# EAGLE design Motor Controller (EAGLE 8.6.0)
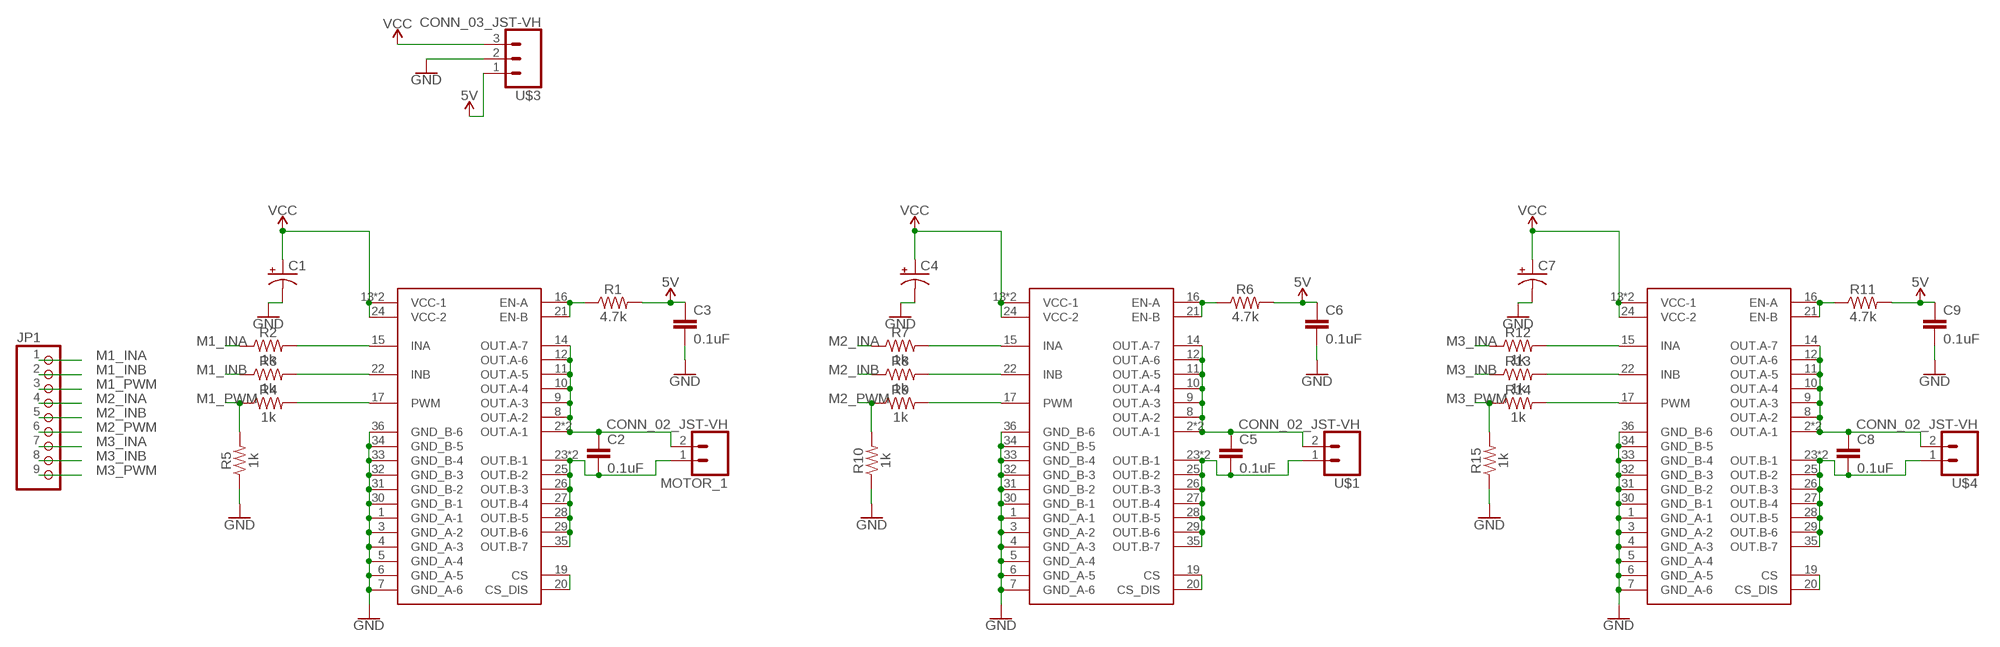
[diagram p0: schematic, sheet 1]

## Parts
C1  CPOL-USE3.5-8  [E3,5-8]
C2  0.1uF  0.1UF-0603-25V-(+80/-20%)  [0603]
C3  0.1uF  0.1UF-0603-25V-(+80/-20%)  [0603]
C4  CPOL-USE3.5-8  [E3,5-8]
C5  0.1uF  0.1UF-0603-25V-(+80/-20%)  [0603]
C6  0.1uF  0.1UF-0603-25V-(+80/-20%)  [0603]
C7  CPOL-USE3.5-8  [E3,5-8]
C8  0.1uF  0.1UF-0603-25V-(+80/-20%)  [0603]
C9  0.1uF  0.1UF-0603-25V-(+80/-20%)  [0603]
JP1  PINHD-1X9  [1X09]
M1  M1  SOP50P1030X247-36N  [SOP50P1030X247-36N]
M2  M2  SOP50P1030X247-36N  [SOP50P1030X247-36N]
M3  M3  SOP50P1030X247-36N  [SOP50P1030X247-36N]
MOTOR_1  CONN_02_JST-VH  [B2P-VH]
R1  4.7k  4.7KOHM-0603-1/10W-1%  [0603]
R2  1k  1KOHM-0603-1/10W-1%  [0603]
R3  1k  1KOHM-0603-1/10W-1%  [0603]
R4  1k  1KOHM-0603-1/10W-1%  [0603]
R5  1k  1KOHM-0603-1/10W-1%  [0603]
R6  4.7k  4.7KOHM-0603-1/10W-1%  [0603]
R7  1k  1KOHM-0603-1/10W-1%  [0603]
R8  1k  1KOHM-0603-1/10W-1%  [0603]
R9  1k  1KOHM-0603-1/10W-1%  [0603]
R10  1k  1KOHM-0603-1/10W-1%  [0603]
R11  4.7k  4.7KOHM-0603-1/10W-1%  [0603]
R12  1k  1KOHM-0603-1/10W-1%  [0603]
R13  1k  1KOHM-0603-1/10W-1%  [0603]
R14  1k  1KOHM-0603-1/10W-1%  [0603]
R15  1k  1KOHM-0603-1/10W-1%  [0603]
U$1  CONN_02_JST-VH  [B2P-VH]
U$3  CONN_03_JST-VH  [B3P-VH]
U$4  CONN_02_JST-VH  [B2P-VH]

## Nets
5V: C3.1 C6.1 C9.1 R1.2 R6.2 R11.2 U$3.1
GND: C1.- C3.2 C4.- C6.2 C7.- C9.2 M1.1(GND_A-1) M1.3(GND_A-2) M1.4(GND_A-3) M1.5(GND_A-4) M1.6(GND_A-5) M1.7(GND_A-6) M1.30(GND_B-1) M1.31(GND_B-2) M1.32(GND_B-3) M1.33(GND_B-4) M1.34(GND_B-5) M1.36(GND_B-6) M2.1(GND_A-1) M2.3(GND_A-2) M2.4(GND_A-3) M2.5(GND_A-4) M2.6(GND_A-5) M2.7(GND_A-6) M2.30(GND_B-1) M2.31(GND_B-2) M2.32(GND_B-3) M2.33(GND_B-4) M2.34(GND_B-5) M2.36(GND_B-6) M3.1(GND_A-1) M3.3(GND_A-2) M3.4(GND_A-3) M3.5(GND_A-4) M3.6(GND_A-5) M3.7(GND_A-6) M3.30(GND_B-1) M3.31(GND_B-2) M3.32(GND_B-3) M3.33(GND_B-4) M3.34(GND_B-5) M3.36(GND_B-6) R5.1 R10.1 R15.1 U$3.2
M1_INA: JP1.1 R2.1
M1_INB: JP1.2 R3.1
M1_PWM: JP1.3 R4.1 R5.2
M2_INA: JP1.4 R7.1
M2_INB: JP1.5 R8.1
M2_PWM: JP1.6 R9.1 R10.2
M3_INA: JP1.7 R12.1
M3_INB: JP1.8 R13.1
M3_PWM: JP1.9 R14.1 R15.2
N$1: C5.1 M2.2(OUT.A-1) M2.8(OUT.A-2) M2.9(OUT.A-3) M2.10(OUT.A-4) M2.11(OUT.A-5) M2.12(OUT.A-6) M2.14(OUT.A-7) M2.SLUG2(OUT.A-1) U$1.2
N$2: C2.1 M1.2(OUT.A-1) M1.8(OUT.A-2) M1.9(OUT.A-3) M1.10(OUT.A-4) M1.11(OUT.A-5) M1.12(OUT.A-6) M1.14(OUT.A-7) M1.SLUG2(OUT.A-1) MOTOR_1.2
N$3: C2.2 M1.23(OUT.B-1) M1.25(OUT.B-2) M1.26(OUT.B-3) M1.27(OUT.B-4) M1.28(OUT.B-5) M1.29(OUT.B-6) M1.35(OUT.B-7) M1.SLUG3(OUT.B-1) MOTOR_1.1
N$4: M1.19(CS) M1.20(CS_DIS)
N$5: M1.16(EN-A) M1.21(EN-B) R1.1
N$6: C5.2 M2.23(OUT.B-1) M2.25(OUT.B-2) M2.26(OUT.B-3) M2.27(OUT.B-4) M2.28(OUT.B-5) M2.29(OUT.B-6) M2.35(OUT.B-7) M2.SLUG3(OUT.B-1) U$1.1
N$7: M2.19(CS) M2.20(CS_DIS)
N$8: M1.15(INA) R2.2
N$9: M1.22(INB) R3.2
N$10: M1.17(PWM) R4.2
N$11: M2.16(EN-A) M2.21(EN-B) R6.1
N$12: M2.15(INA) R7.2
N$13: M2.22(INB) R8.2
N$14: M2.17(PWM) R9.2
N$15: C8.1 M3.2(OUT.A-1) M3.8(OUT.A-2) M3.9(OUT.A-3) M3.10(OUT.A-4) M3.11(OUT.A-5) M3.12(OUT.A-6) M3.14(OUT.A-7) M3.SLUG2(OUT.A-1) U$4.2
N$16: C8.2 M3.23(OUT.B-1) M3.25(OUT.B-2) M3.26(OUT.B-3) M3.27(OUT.B-4) M3.28(OUT.B-5) M3.29(OUT.B-6) M3.35(OUT.B-7) M3.SLUG3(OUT.B-1) U$4.1
N$17: M3.19(CS) M3.20(CS_DIS)
N$18: M3.16(EN-A) M3.21(EN-B) R11.1
N$19: M3.15(INA) R12.2
N$20: M3.22(INB) R13.2
N$21: M3.17(PWM) R14.2
VCC: C1.+ C4.+ C7.+ M1.13(VCC-1) M1.24(VCC-2) M1.SLUG1(VCC-1) M2.13(VCC-1) M2.24(VCC-2) M2.SLUG1(VCC-1) M3.13(VCC-1) M3.24(VCC-2) M3.SLUG1(VCC-1) U$3.3

## Library data of the parts
C1 C4 C7 = adafruit:CPOL-US: POLARIZED CAPACITOR, American symbol
C2 C3 C5 C6 C8 C9 = SparkFun-Capacitors:0.1UF: 0.1µF ceramic capacitors A capacitor is a passive two-terminal electrical component used to store electrical energy temporarily in an electric field.; PROD_ID: CAP-00810
JP1 = pinhead:PINHD-1X9: PIN HEADER
M1-M3 = VNH5050ATR-E:SOP50P1030X247-36N; A1_MAX: 0.32; A1_MIN: 0.23; A1_NOM: 0.275; A_MAX: 2.47; A_MIN: 2.15; A_NOM: 2.31; B_MAX: 0.36; B_MIN: 0.18; B_NOM: 0.27; D2_MAX: 0.0; D2_MIN: None; D2_NOM: None; D_MAX: 10.5; D_MIN: 10.1; D_NOM: 10.3; E1_MAX: 7.6; E1_MIN: 7.4; E1_NOM: 7.5; E2_MAX: 0.0; E2_MIN: None; E2_NOM: None; ENOM: 0.5; E_MAX: 10.5; E_MIN: 10.1; E_NOM: 10.3; L_MAX: 1.0; L_MIN: 0.6; L_NOM: 0.8; MANUFACTURER: STMicroelectronics; PIN_COUNT: 36.0; SNAPEDA_PACKAGE_ID: 23434
MOTOR_1 U$1 U$4 = JST-VH:CONN_02_JST-VH: B2P-VH(LF)(SN) Digikey <https://www.digikey.com.au/product-detail/en/jst-sales-america-inc/B2P-VH-LF-SN/455-1639-ND/926547>
R1 R6 R11 = SparkFun-Resistors:4.7KOHM: 4.7kΩ resistor A resistor is a passive two-terminal electrical component that implements electrical resistance as a circuit element. Resistors act to reduce current flow, and, at the same time, act to lower voltage levels within circuits. - Wikipedia; PROD_ID: RES-07857
R2-R5 R7-R10 R12-R15 = SparkFun-Resistors:1KOHM: 1kΩ resistor A resistor is a passive two-terminal electrical component that implements electrical resistance as a circuit element. Resistors act to reduce current flow, and, at the same time, act to lower voltage levels within circuits. - Wikipedia; PROD_ID: RES-07856
U$3 = JST-VH:CONN_03_JST-VH: B3P-VH(LF)(SN) Digikey <https://www.digikey.com.au/products/en?keywords=455-1640-ND>

## Board
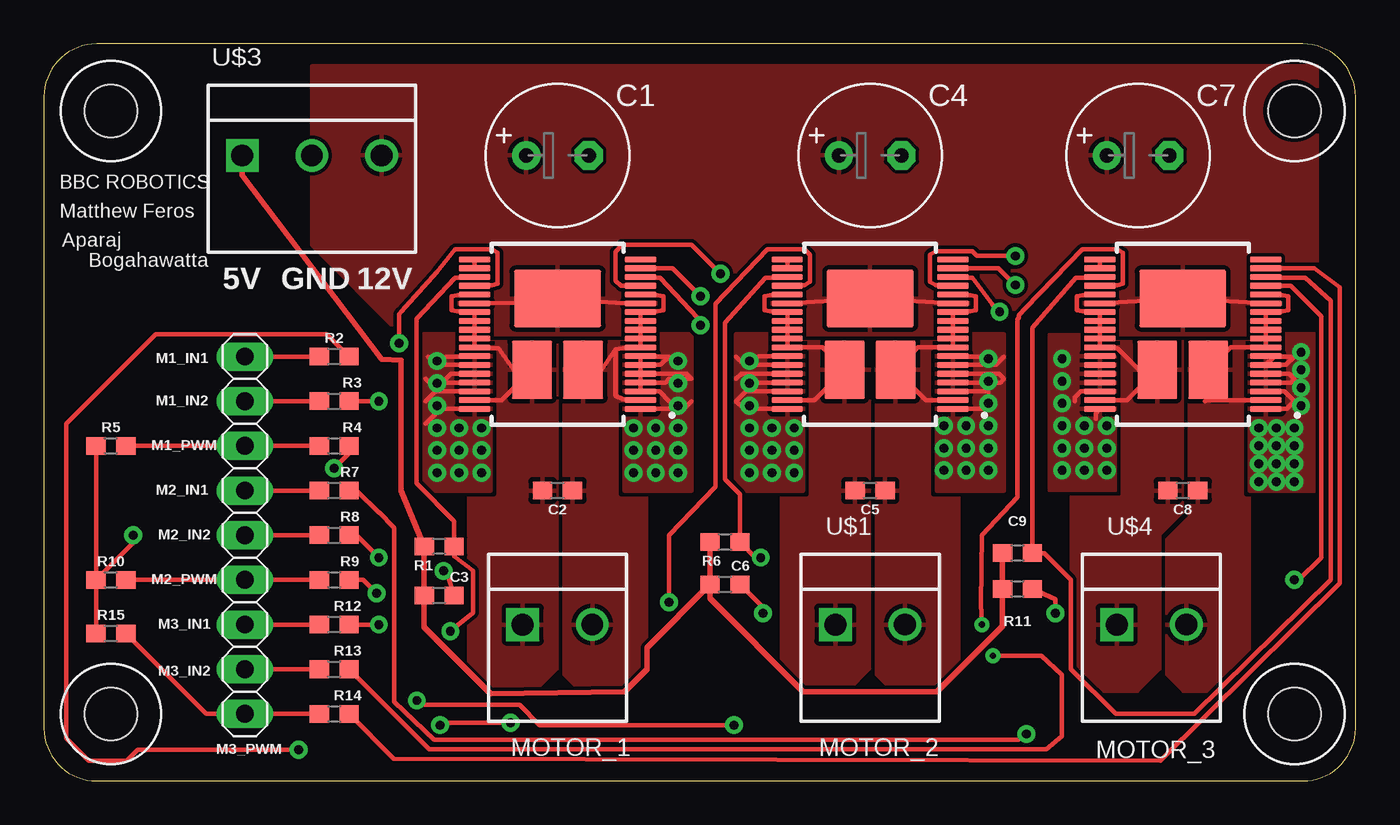
[diagram p1: board, top side]
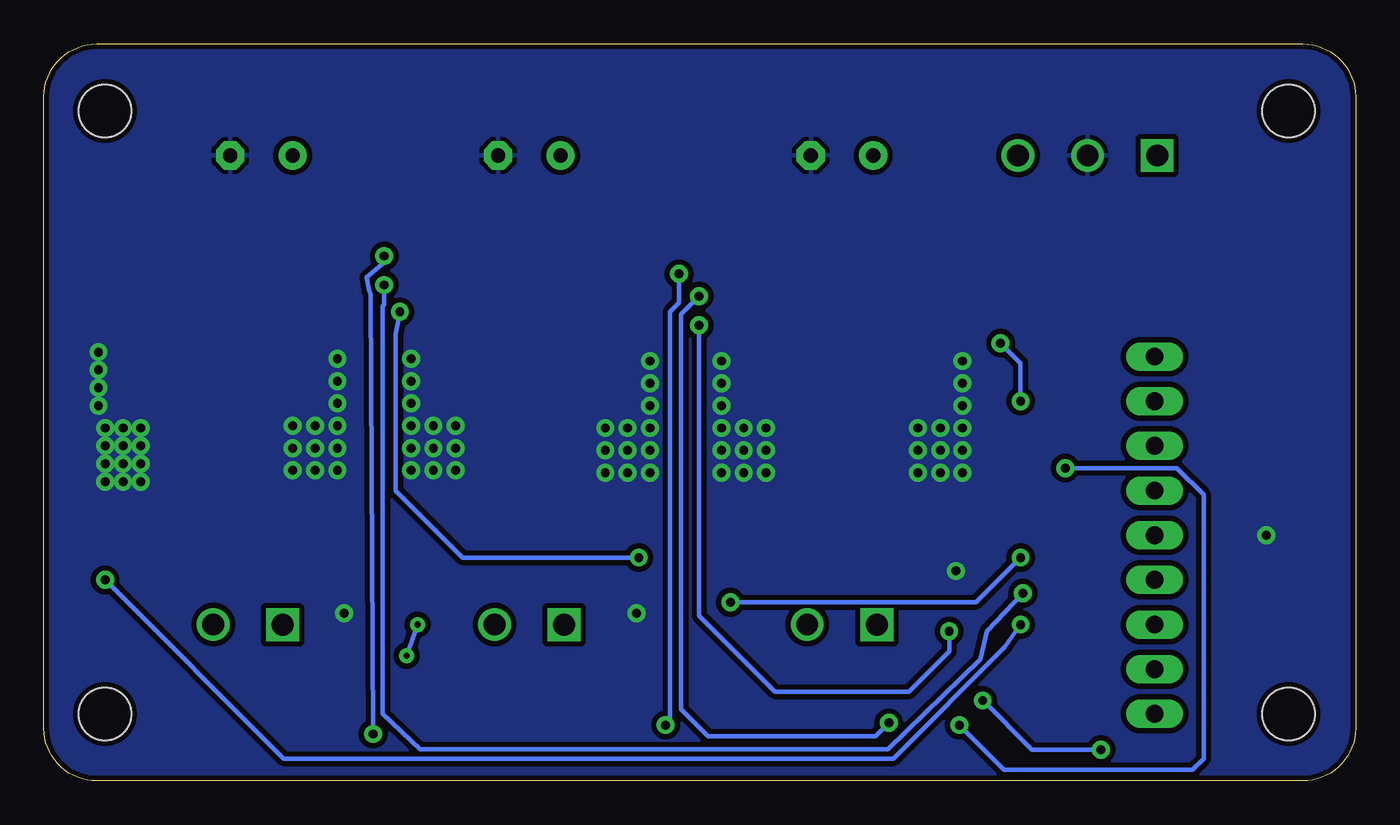
[diagram p2: board, bottom side, seen from below]

Size 74.6 x 41.9 mm. Coordinates in mm from the lower left corner, seen from the top.
Outline: 0,38.9 0,3 arc90 3,0 71.6,0 arc90 74.6,3 74.6,38.9 arc90 71.6,41.9 3,41.9 arc90 0,38.9
Copper layers (1*16): Top 0.035mm / dielectric 1.5mm / Bottom 0.035mm
Design rules "SparkFun": minimum track width 8mil, minimum drill 20mil, track to track 8mil, track to pad 8mil, pad to pad 8mil, via to via 8mil, smd to smd 8mil, copper to edge 10mil, drill to drill 8mil, minimum pad ring 12mil, minimum via ring 10mil, stop-mask expansion 4mil, vias tented up to drill 25mil, thermal gap 10mil
Holes 3 mm at 3.81,38.1 71.12,38.1 71.12,3.81 3.81,3.81

### Footprints (pad centres in the part's own frame; a part is rotated, then mirrored left to right if it is on the bottom)
E3,5-8 = drill 0.813 pad 1.6: + -1.778,0 | drill 0.813 pad 1.6 octagon: - 1.778,0
0603 = smd 1.1 x 1: 1 -0.85,0; 2 0.85,0
1X09 = drill 1.016 long: 1 -10.16,0; 2 -7.62,0; 3 -5.08,0; 4 -2.54,0; 5 0,0; 6 2.54,0; 7 5.08,0; 8 7.62,0; 9 10.16,0
SOP50P1030X247-36N = smd 1.79 x 0.35: 1 -4.715,4.25; 2 -4.715,3.75; 3 -4.715,3.25; 4 -4.715,2.75; 5 -4.715,2.25; 6 -4.715,1.75; 7 -4.715,1.25; 8 -4.715,0.75; 9 -4.715,0.25; 10 -4.715,-0.25; 11 -4.715,-0.75; 12 -4.715,-1.25; 13 -4.715,-1.75; 14 -4.715,-2.25; 15 -4.715,-2.75; 16 -4.715,-3.25; 17 -4.715,-3.75; 18 -4.715,-4.25; 19 4.715,-4.25; 20 4.715,-3.75; 21 4.715,-3.25; 22 4.715,-2.75; 23 4.715,-2.25; 24 4.715,-1.75; 25 4.715,-1.25; 26 4.715,-0.75; 27 4.715,-0.25; 28 4.715,0.25; 29 4.715,0.75; 30 4.715,1.25; 31 4.715,1.75; 32 4.715,2.25; 33 4.715,2.75; 34 4.715,3.25; 35 4.715,3.75; 36 4.715,4.25 | smd 4.95 x 3.25: SLUG1 0,-2.025 | smd 2.286 x 3.302: SLUG2 -1.45,2.025; SLUG3 1.45,2.025
B2P-VH = drill 1.25 square: 1 -1.98,0 | drill 1.24: 2 1.98,0
B3P-VH = drill 1.24 square: 1 -3.96,0 | drill 1.24: 2 0,0; 3 3.96,0

### Placement (x,y rotation side)
C1  29.21,35.56 0 top
C2  29.21,16.51 180 top
C3  22.48,10.54 0 top
C4  46.99,35.56 0 top
C5  46.99,16.51 180 top
C6  38.73,11.18 0 top
C7  62.23,35.56 0 top
C8  64.77,16.51 180 top
C9  55.37,10.92 0 top
JP1  11.43,13.97 270 top
M1  29.21,25.4 180 top
M2  46.99,25.4 180 top
M3  64.77,25.4 180 top
MOTOR_1  29.21,8.89 0 top
R1  22.48,13.34 180 top
R2  16.51,24.13 0 top
R3  16.51,21.59 0 top
R4  16.51,19.05 0 top
R5  3.81,19.05 0 top
R6  38.73,13.59 180 top
R7  16.51,16.51 0 top
R8  16.51,13.97 0 top
R9  16.51,11.43 0 top
R10  3.81,11.43 0 top
R11  55.37,12.95 180 top
R12  16.51,8.89 0 top
R13  16.51,6.35 0 top
R14  16.51,3.81 0 top
R15  3.81,8.38 0 top
U$1  46.99,8.89 0 top
U$3  15.24,35.56 0 top
U$4  62.99,8.89 0 top

### Tracks (layer width: path | path; a pad name or v marks a point on that pad's centre or on a via)
5V
  Top 0.305: R11.2 C9.1 54.52,8.8 50.8,5.08 43.18,5.08 37.88,10.38 C6.1 | C6.1 R6.2 | C6.1 34.29,7.58 34.29,6.35 33.02,5.08 25.4,4.95 21.63,8.72 C3.1 R1.2 20.32,16.51 20.32,23.93 19.22,23.96 11.28,34.44 U$3.1
GND  (via drill 0.51, 0.51 pad 0.51)
  Top 0.254: R5.1 R10.1 | R10.1 R15.1 | R10.1 5.08,13.55 v5.08,13.97 | M3.7 69.5,24.13 69.97,24.13 | M3.1 70.68,21.15 71.12,21.59 70.56,22.15 M3.3 | M3.4 70.91,22.65 71.12,22.86 70.83,23.15 M3.5 | 69.97,24.13 M3.6 70.64,23.65 71.12,24.13 69.97,24.13 | M3.34 58.98,22.15 58.65,21.82 58.65,21.59 | M3.36 59.82,20.91 59.82,20.6 | C9.2 57.53,10.33 v57.53,9.53 | M2.7 51.73,24.13 53.34,24.13 | M2.6 54.13,23.65 54.61,24.13 | M2.5 54.32,23.15 54.61,22.86 54.4,22.65 M2.4 | M2.3 53.67,22.15 53.72,22.1 | M2.1 53.65,21.15 53.72,21.08 | M2.30 40.66,24.15 40.64,24.13 | M2.31 39.85,23.65 39.37,24.13 | M2.32 39.66,23.15 39.37,22.86 | M2.33 40.43,22.65 39.93,22.15 | M2.34 39.93,22.15 | 39.93,22.15 39.37,21.59 39.81,21.15 M2.36 | C6.2 40.89,9.87 v40.89,9.53 | M1.6 M1.7 33.95,24.13 35.56,24.13 35.08,23.65 M1.6 | M1.6 M1.5 | M1.5 M1.4 | M1.4 M1.3 35,22.15 35.56,21.59 | M1.5 36.54,23.15 36.83,22.86 35.56,22.86 35.35,22.65 M1.4 | M1.1 36.39,21.15 36.83,21.59 | M1.30 24.48,24.13 22.86,24.13 | M1.31 22.32,23.65 21.84,24.13 | M1.32 23.15,23.15 22.86,22.86 | M1.33 21.93,22.65 21.72,22.86 | M1.34 22.28,22.15 21.72,21.59 | M1.36 22.55,21.15 21.72,20.32 | C3.2 22.95,11.72 v22.73,11.94
  other vias: 69.09,20.07 70.1,20.07 71.12,20.07 69.09,19.05 70.1,19.05 71.12,19.05 71.12,18.03 70.1,18.03 69.09,18.03 69.09,17.02 70.1,17.02 71.12,17.02 71.5,24.38 71.5,23.37 71.5,22.35 71.5,21.34 60.45,20.19 59.18,20.19 57.91,20.19 57.91,18.92 57.91,17.65 59.18,18.92 59.18,17.65 60.45,17.65 60.45,18.92 57.91,21.46 57.91,22.73 57.91,24 51.18,20.19 52.45,20.19 53.72,20.19 53.72,18.92 53.72,17.65 52.45,17.65 52.45,18.92 51.18,18.92 51.18,17.65 53.72,21.46 53.72,22.73 53.72,24 42.67,20.07 41.4,20.07 40.13,20.07 40.13,18.8 40.13,17.53 41.4,17.53 42.67,17.53 42.67,18.8 41.4,18.8 40.13,21.34 40.13,22.61 40.13,23.88 33.53,20.07 34.8,20.07 36.07,20.07 36.07,18.8 34.8,18.8 33.53,18.8 33.53,17.53 34.8,17.53 36.07,17.53 36.07,21.34 36.07,22.61 36.07,23.88 24.89,20.07 23.62,20.07 22.35,20.07 22.35,18.8 22.35,17.53 23.62,17.53 24.89,17.53 24.89,18.8 23.62,18.8 22.35,21.34 22.35,22.61 22.35,23.88
  pour Bottom (isolate 0.305): -6.35,45.72 -6.35,-2.54 77.47,-2.54 77.47,46.99 -6.35,46.99
  pour Top (isolate 0.203, rank 2): 69.85,25.4 68.58,25.4 68.58,16.51 72.39,16.51 72.39,25.4
  pour Top (isolate 0.203, rank 2): 60.96,25.4 57.15,25.4 57.15,16.51 60.96,16.51
  pour Top (isolate 0.203, rank 2): 50.8,25.4 50.8,16.51 54.61,16.51 54.61,25.4
  pour Top (isolate 0.203, rank 2): 43.18,25.4 39.37,25.4 39.37,16.51 43.18,16.51
  pour Top (isolate 0.203, rank 2): 33.02,25.4 33.02,16.51 36.83,16.51 36.83,25.4
  pour Top (isolate 0.203, rank 2): 25.4,25.4 21.59,25.4 21.59,16.51 25.4,16.51
M1_INA
  Top 0.254: JP1.1 R2.1
M1_INB
  Top 0.254: JP1.2 R3.1
M1_PWM
  Top 0.254: R4.1 JP1.3 R5.2
M2_INA
  Top 0.254: JP1.4 R7.1
M2_INB
  Top 0.254: JP1.5 R8.1
M2_PWM
  Top 0.254: R9.1 JP1.6 R10.2
M3_INA
  Top 0.254: JP1.7 R12.1
M3_INB
  Top 0.254: JP1.8 R13.1
M3_PWM
  Top 0.254: R14.1 JP1.9 9.23,3.81 R15.2
N$1
  Top 0.254: M2.14 51.75,27.6 52.69,27.6 53.01,27.54 53.01,26.76 52.69,26.7 51.75,26.7 M2.12 M2.11 M2.10 M2.9 M2.8 49.72,24.65 M2.SLUG2 50.16,21.65 M2.2
  pour Top (isolate 0.203, rank 4): 46.99,25.4 46.99,6.35 48.26,5.08 50.8,5.08 52.07,6.35 52.07,19.05 54.61,21.59 54.61,22.86 54.61,24.13 53.34,25.4
N$2
  Top 0.254: 32.5,24.54 32.5,21.89 32.94,21.7 33.88,21.7 M1.2 | M1.14 33.97,27.7 34.29,27.7 34.38,27.6 34.91,27.6 35.23,27.54 35.23,26.76 34.91,26.7 33.97,26.7 M1.12 M1.11 M1.10 M1.9 M1.8 33.88,24.6 32.94,24.6 32.5,24.54 | 32.5,24.54 31.71,23.38 M1.SLUG2
  pour Top (isolate 0.203, rank 4): 29.21,25.4 35.56,25.4 36.83,24.13 36.83,21.59 35.56,20.32 34.29,19.05 34.29,6.35 33.02,5.08 30.48,5.08 29.21,6.35
N$3
  Top 0.254: M1.35 26.04,21.65 M1.SLUG3 26.71,23.38 25.86,24.6 24.54,24.6 M1.29 M1.28 M1.27 M1.26 M1.25 24.48,26.67 24.13,26.67 24.1,26.7 23.51,26.7 23.19,26.76 23.19,27.54 23.51,27.6 24.45,27.6 M1.23
  pour Top (isolate 0.203, rank 3): 29.21,25.4 22.86,25.4 21.59,24.13 21.59,21.59 24.13,19.05 24.13,6.35 25.4,5.08 27.94,5.08 29.21,6.35
N$4
  Top 0.254: M1.19 M1.20
N$5  (via drill 0.51)
  Top 0.254: M1.21 24.45,28.6 23.38,28.6 21.18,26.28 21.18,16.92 23.33,14.77 R1.1 23.33,12.77 24.41,11.94 24.41,9.55 v23.11,8.51 | M1.16 33.97,28.6 35.04,28.6 37.18,26.33 37.18,26.07 v37.34,25.91
  Bottom 0.254: v37.34,25.91 37.34,9.4 33.02,5.08 25.4,5.08 23.11,7.37 v23.11,8.51
N$6
  Top 0.254: M2.23 42.23,27.6 41.29,27.6 40.97,27.54 40.97,26.76 41.29,26.7 41.88,26.7 41.91,26.67 42.26,26.67 M2.25 M2.26 M2.27 M2.28 M2.29 44.27,24.65 M2.SLUG3 43.81,21.65 M2.35
  pour Top (isolate 0.203, rank 3): 46.99,25.4 40.64,25.4 39.37,24.13 39.37,21.59 41.91,19.05 41.91,6.35 43.18,5.08 45.72,5.08 46.99,6.35
N$7
  Top 0.254: M2.20 M2.19
N$8  (via drill 0.51)
  Top 0.254: M1.15 32.81,28.15 32.51,28.45 32.51,30.1 32.89,30.48 36.83,30.48 v38.48,28.83 | v39.24,3.17 28.19,3.17 27.05,4.32 21.46,4.32 v21.21,4.57 | v14.48,1.78 5.33,1.78 4.7,1.14 2.54,1.14 1.27,2.41 1.27,20.32 6.35,25.4 16.09,25.4 R2.2
  Bottom 0.254: v38.48,28.83 38.48,27.18 38.99,26.67 38.99,3.43 v39.24,3.17 | v21.21,4.57 18.41,1.78 v14.48,1.78
N$9  (via drill 0.51)
  Top 0.254: v20.19,24.89 20.19,26.54 20.32,26.67 22.36,28.96 23.38,30.23 25.48,30.23 25.8,30.04 25.8,28.26 25.48,28.2 24.54,28.2 M1.22 | v19.05,21.59 R3.2
  Bottom 0.254: v20.19,24.89 19.05,23.75 v19.05,21.59
N$10  (via drill 0.51)
  Top 0.254: M1.17 35.75,29.15 v37.34,27.56 | v26.54,3.3 22.66,3.3 v22.54,3.17 | v16.51,17.78 17.36,18.63 R4.2
  Bottom 0.254: v37.34,27.56 38.35,26.54 38.35,4.06 36.83,2.54 27.3,2.54 v26.54,3.3 | v22.54,3.17 20,0.64 9.27,0.64 8.64,1.27 8.64,16.26 10.16,17.78 v16.51,17.78
N$11  (via drill 0.51)
  Top 0.254: M2.16 51.75,28.6 52.82,28.6 53.95,27.09 53.95,27.08 v54.36,26.67 | v40.77,12.7 40.47,12.7 R6.1 39.59,16.3 38.73,17.14 38.73,26.05 41.04,28.6 42.23,28.6 M2.21
  Bottom 0.254: v54.36,26.67 54.61,25.4 54.61,16.51 50.8,12.7 v40.77,12.7
N$12  (via drill 0.51)
  Top 0.254: M2.15 51.66,28.2 50.72,28.2 50.4,28.39 50.4,29.91 50.72,30.1 52.82,30.1 53.08,29.84 v55.24,29.84 | v55.88,2.67 55.42,2.34 22.2,2.34 19.91,4.5 19.91,14.4 19.05,15.27 19.05,15.24 17.78,16.51 R7.2
  Bottom 0.254: v55.24,29.84 55.37,29.36 56.24,28.63 56.11,27.89 56.01,27.66 v55.88,2.67
N$13  (via drill 0.51)
  Top 0.254: M2.22 42.32,28.2 43.26,28.2 43.58,28.39 43.58,29.91 43.26,30.23 41.16,30.23 38.2,27.14 38.2,16.74 35.56,13.97 v35.56,10.16 | v19.05,12.7 17.78,13.97 R8.2
  Bottom 0.254: v35.56,10.16 21.59,10.16 v19.05,12.7
N$14  (via drill 0.51)
  Top 0.254: M2.17 54.29,29.15 v55.24,28.19 | v18.92,10.67 18.16,11.43 R9.2
  Bottom 0.254: v55.24,28.19 55.24,27.08 55.35,26.98 55.35,3.81 53.21,1.8 26.58,1.8 21.34,6.92 20.95,8.51 v18.92,10.67
N$15
  Top 0.254: M3.14 69.53,27.6 70.47,27.6 70.79,27.54 70.79,26.76 70.47,26.7 69.53,26.7 M3.12 M3.11 M3.10 M3.9 M3.8 67.5,24.65 M3.SLUG2 66.22,21.77 66.1,21.65 | M3.2 66.1,21.65 | 66.1,21.65 66.04,21.59
  pour Top (isolate 0.203, rank 4): 64.77,25.4 71.12,25.4 72.39,24.13 72.39,21.59 69.85,19.05 68.58,17.78 68.58,6.35 67.31,5.08 64.77,5.08 63.5,6.35 63.5,13.97 64.77,15.24
N$16
  Top 0.254: M3.35 61.59,21.65 M3.SLUG3 62.27,23.38 61.04,24.6 60.1,24.6 M3.29 M3.28 M3.27 M3.26 M3.25 60.03,26.67 59.69,26.67 59.66,26.7 59.07,26.7 58.75,26.76 58.75,27.54 59.07,27.6 60.01,27.6 M3.23
  pour Top (isolate 0.203, rank 3): 58.42,25.4 57.15,24.13 57.15,21.59 58.42,20.32 58.42,6.35 59.69,5.08 62.23,5.08 63.5,6.35 63.5,13.97 64.77,15.24 64.77,25.4
N$17
  Top 0.254: M3.19 M3.20
N$18
  Top 0.254: M3.21 60.01,28.6 58.69,28.6 56.22,25.76 R11.1 56.9,12.95 58.42,11.43 58.42,6.35 60.96,3.81 65.43,3.81 73.18,11.43 73.18,27.29 71.74,28.6 69.53,28.6 M3.16
N$19  (via drill 0.51 pad 0.51)
  Top 0.254: M3.15 70.91,28.15 72.64,26.42 72.64,12.7 71.37,11.43 v71.12,11.43 | v19.05,8.89 R12.2
  Bottom 0.254: v71.12,11.43 60.96,1.27 26.29,1.27 19.94,7.62 v19.05,8.89
N$20  (via drill 0.35)
  Top 0.254: M3.22 60.1,28.2 61.04,28.2 61.36,28.26 61.36,30.04 61.04,30.23 59.07,30.23 55.83,26.86 55.45,26.48 55.45,26.32 55.37,26.25 55.37,16.13 53.34,13.97 53.3,10.07 v53.34,8.89 | R13.2 21.91,1.8 57.02,1.8 57.89,2.54 57.89,6.03 56.74,7.11 v53.98,7.11
  Bottom 0.254: v53.98,7.11 v53.34,8.89
N$21
  Top 0.254: M3.17 72.25,29.15 73.71,28.07 73.71,11.23 63.5,1.14 19.9,1.27 R14.2
VCC
  Top 0.254: M1.13 32.51,27.18 M1.SLUG1 27.05,27.18 M1.24 | M3.24 M3.SLUG1 M3.13 | M2.24 M2.SLUG1 M2.13
  pour Top (isolate 0.203): 29.21,25.4 71.12,25.4 72.39,26.67 72.39,40.64 15.24,40.64 15.24,30.48 20.32,25.4

### Text on the board
tPlace: BBC ROBOTICS | Matthew Feros | Aparaj | Bogahawatta | 5V | GND | 12V | M1_IN1 | M1_IN2 | M1_PWM | M2_IN1 | M2_IN2 | M2_PWM | M3_IN1 | M3_IN2 | M3_PWM | MOTOR_2 | MOTOR_3